# Altium project Motor_Driver_3_Phase.PrjPcb
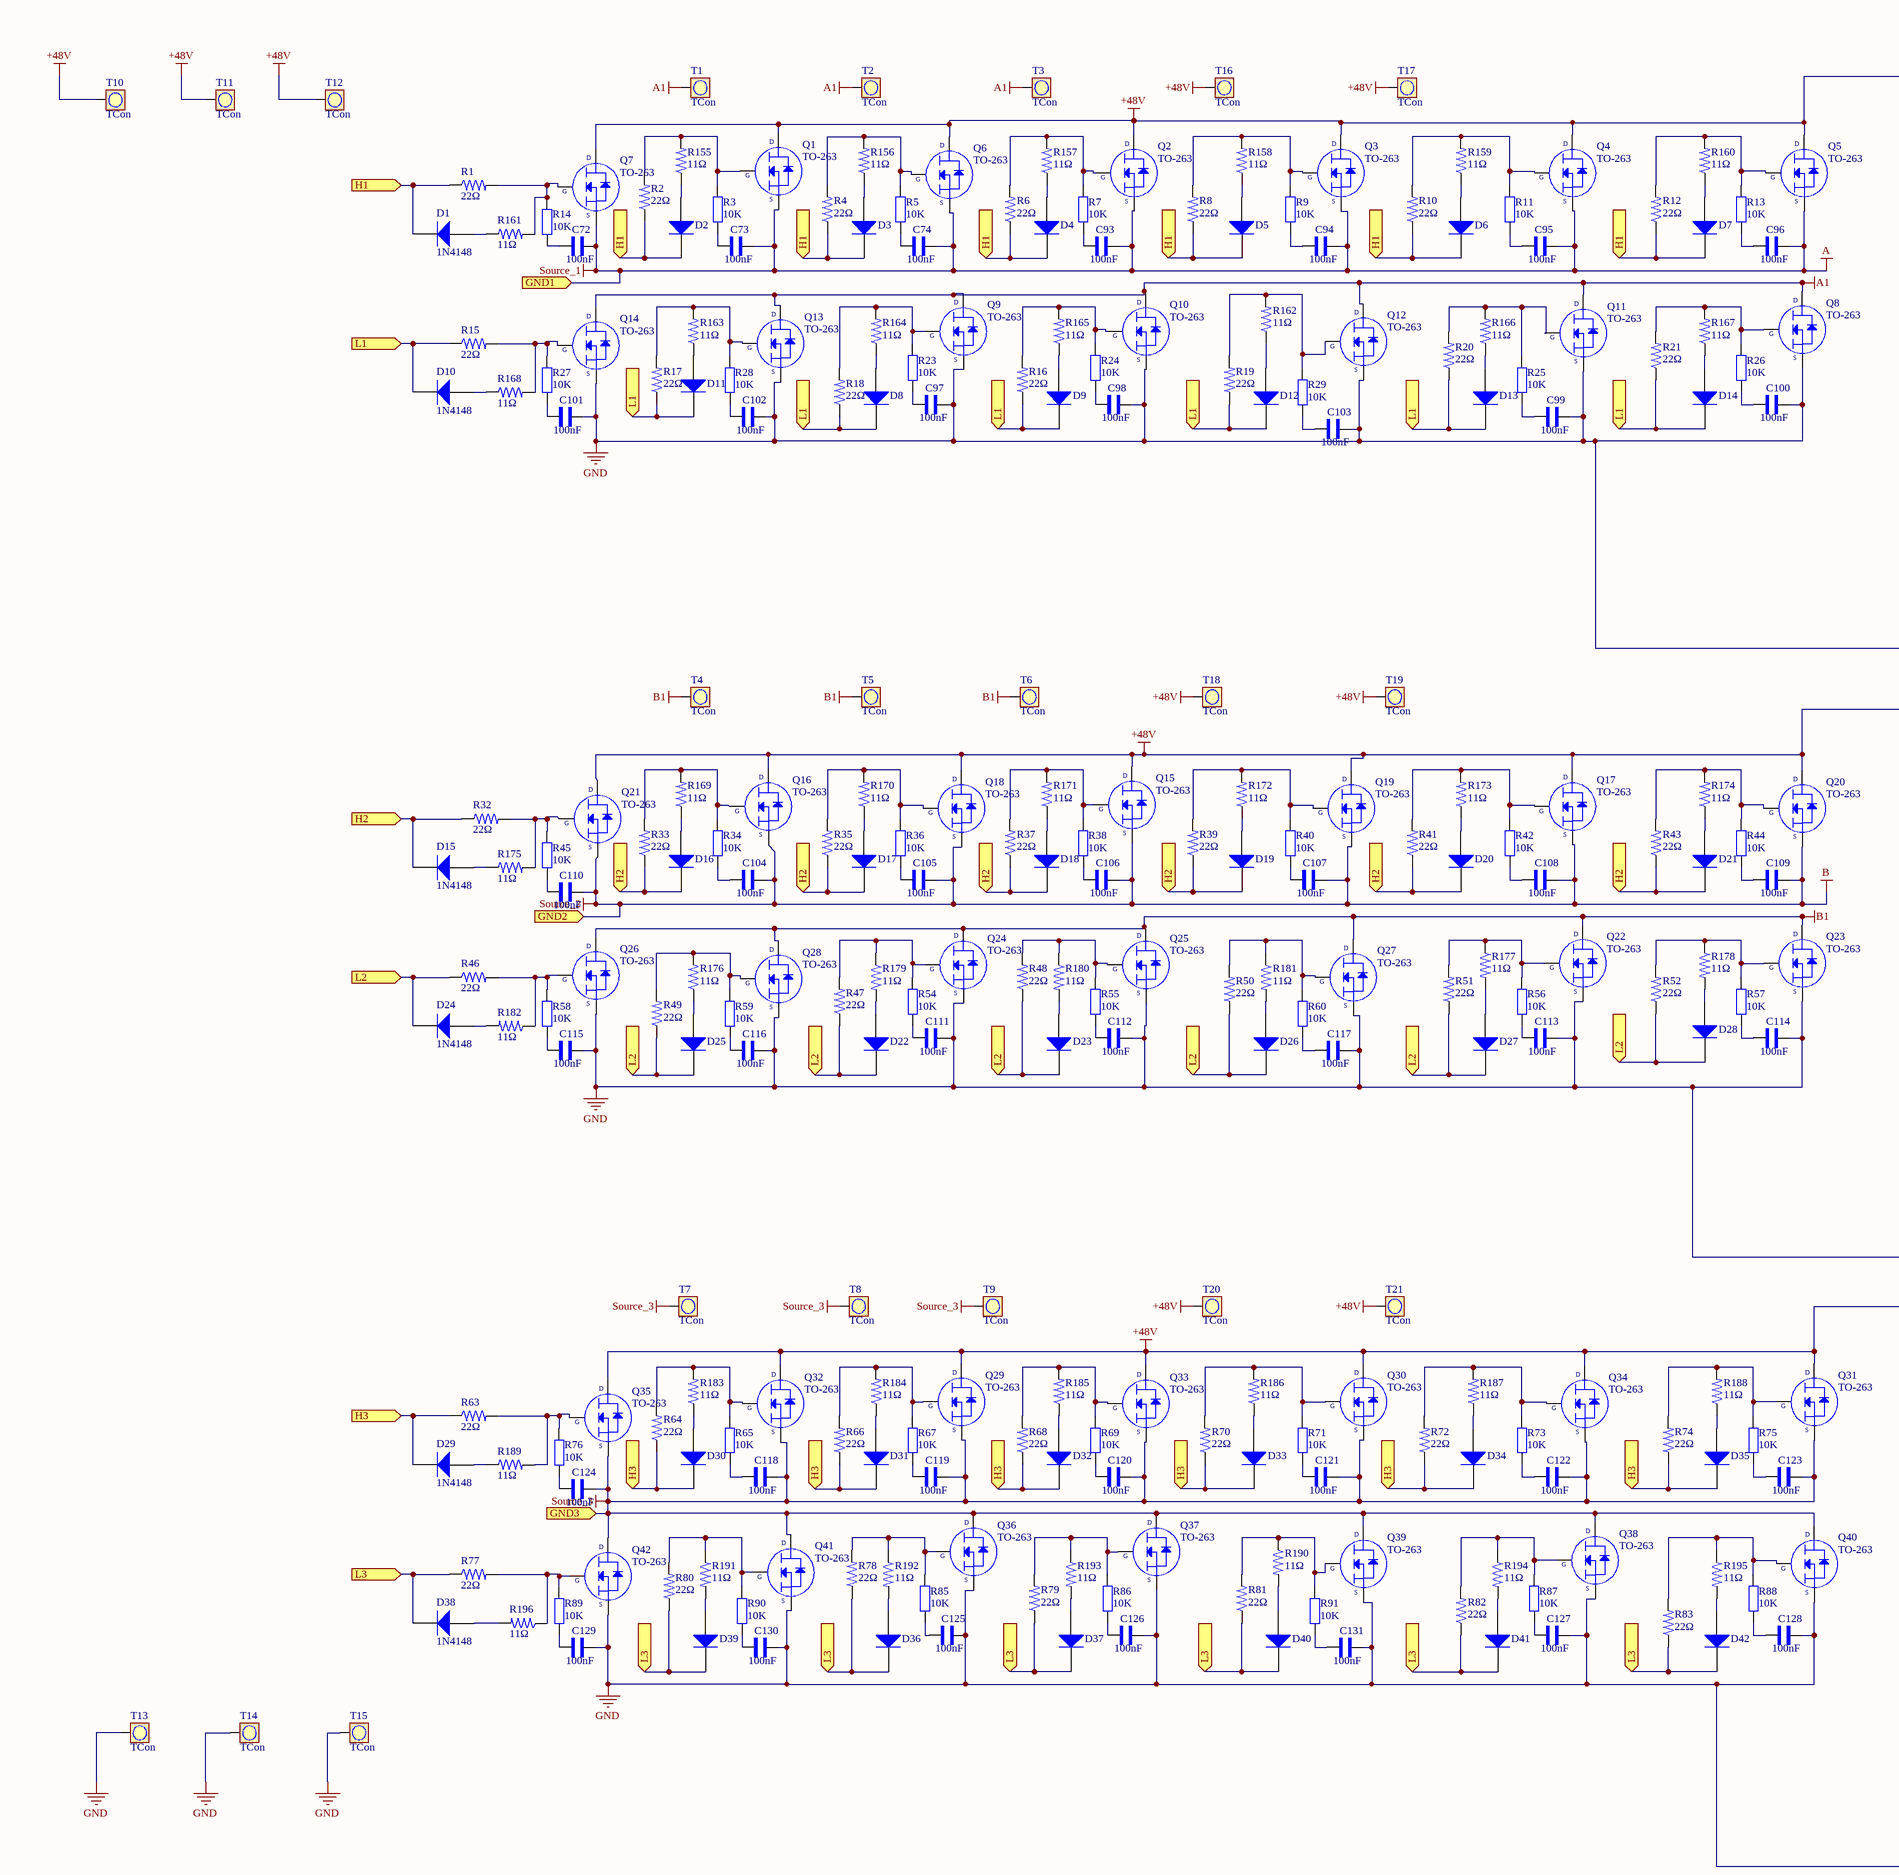
[diagram p0: Mosfet.SchDoc, left]
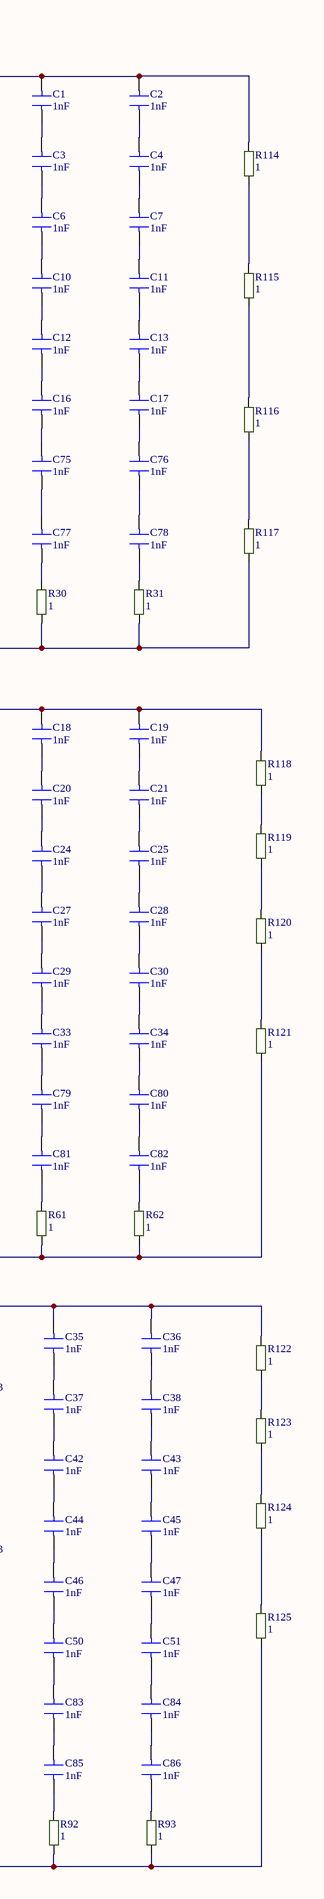
[diagram p1: Mosfet.SchDoc, right]
4 sheets, 448 parts. Net scope: flat (ports and power ports of the same name join across sheets).
Board files: Motor_Driver_3_Phase.PcbDoc, Connector.PcbDoc
Sheets:
  Mosfet.SchDoc
  Gate_Driver.SchDoc
  Parallel_Capacitor.SchDoc
  Current_Sensor.SchDoc

## Sheet Mosfet.SchDoc
size A2; SheetNumber: 1; SheetTotal: 5

### Parts
C1  1nF  [CAP 1206_3216 - 1.8MM]
C2  1nF  [CAP 1206_3216 - 1.8MM]
C3  1nF  [CAP 1206_3216 - 1.8MM]
C4  1nF  [CAP 1206_3216 - 1.8MM]
C6  1nF  [CAP 1206_3216 - 1.8MM]
C7  1nF  [CAP 1206_3216 - 1.8MM]
C10  1nF  [CAP 1206_3216 - 1.8MM]
C11  1nF  [CAP 1206_3216 - 1.8MM]
C12  1nF  [CAP 1206_3216 - 1.8MM]
C13  1nF  [CAP 1206_3216 - 1.8MM]
C16  1nF  [CAP 1206_3216 - 1.8MM]
C17  1nF  [CAP 1206_3216 - 1.8MM]
C18  1nF  [CAP 1206_3216 - 1.8MM]
C19  1nF  [CAP 1206_3216 - 1.8MM]
C20  1nF  [CAP 1206_3216 - 1.8MM]
C21  1nF  [CAP 1206_3216 - 1.8MM]
C24  1nF  [CAP 1206_3216 - 1.8MM]
C25  1nF  [CAP 1206_3216 - 1.8MM]
C27  1nF  [CAP 1206_3216 - 1.8MM]
C28  1nF  [CAP 1206_3216 - 1.8MM]
C29  1nF  [CAP 1206_3216 - 1.8MM]
C30  1nF  [CAP 1206_3216 - 1.8MM]
C33  1nF  [CAP 1206_3216 - 1.8MM]
C34  1nF  [CAP 1206_3216 - 1.8MM]
C35  1nF  [CAP 1206_3216 - 1.8MM]
C36  1nF  [CAP 1206_3216 - 1.8MM]
C37  1nF  [CAP 1206_3216 - 1.8MM]
C38  1nF  [CAP 1206_3216 - 1.8MM]
C42  1nF  [CAP 1206_3216 - 1.8MM]
C43  1nF  [CAP 1206_3216 - 1.8MM]
C44  1nF  [CAP 1206_3216 - 1.8MM]
C45  1nF  [CAP 1206_3216 - 1.8MM]
C46  1nF  [CAP 1206_3216 - 1.8MM]
C47  1nF  [CAP 1206_3216 - 1.8MM]
C50  1nF  [CAP 1206_3216 - 1.8MM]
C51  1nF  [CAP 1206_3216 - 1.8MM]
C72  100nF  [C-0805W]
C73  100nF  [C-0805W]
C74  100nF  [C-0805W]
C75  1nF  [CAP 1206_3216 - 1.8MM]
C76  1nF  [CAP 1206_3216 - 1.8MM]
C77  1nF  [CAP 1206_3216 - 1.8MM]
C78  1nF  [CAP 1206_3216 - 1.8MM]
C79  1nF  [CAP 1206_3216 - 1.8MM]
C80  1nF  [CAP 1206_3216 - 1.8MM]
C81  1nF  [CAP 1206_3216 - 1.8MM]
C82  1nF  [CAP 1206_3216 - 1.8MM]
C83  1nF  [CAP 1206_3216 - 1.8MM]
C84  1nF  [CAP 1206_3216 - 1.8MM]
C85  1nF  [CAP 1206_3216 - 1.8MM]
C86  1nF  [CAP 1206_3216 - 1.8MM]
C93  100nF  [C-0805W]
C94  100nF  [C-0805W]
C95  100nF  [C-0805W]
C96  100nF  [C-0805W]
C97  100nF  [C-0805W]
C98  100nF  [C-0805W]
C99  100nF  [C-0805W]
C100  100nF  [C-0805W]
C101  100nF  [C-0805W]
C102  100nF  [C-0805W]
C103  100nF  [C-0805W]
C104  100nF  [C-0805W]
C105  100nF  [C-0805W]
C106  100nF  [C-0805W]
C107  100nF  [C-0805W]
C108  100nF  [C-0805W]
C109  100nF  [C-0805W]
C110  100nF  [C-0805W]
C111  100nF  [C-0805W]
C112  100nF  [C-0805W]
C113  100nF  [C-0805W]
C114  100nF  [C-0805W]
C115  100nF  [C-0805W]
C116  100nF  [C-0805W]
C117  100nF  [C-0805W]
C118  100nF  [C-0805W]
C119  100nF  [C-0805W]
C120  100nF  [C-0805W]
C121  100nF  [C-0805W]
C122  100nF  [C-0805W]
C123  100nF  [C-0805W]
C124  100nF  [C-0805W]
C125  100nF  [C-0805W]
C126  100nF  [C-0805W]
C127  100nF  [C-0805W]
C128  100nF  [C-0805W]
C129  100nF  [C-0805W]
C130  100nF  [C-0805W]
C131  100nF  [C-0805W]
D1  1N4148 Diyot  [SOD-123]  (value not drawn)
D2  1N4148 Diyot  [SOD-123]  (value not drawn)
D3  1N4148 Diyot  [SOD-123]  (value not drawn)
D4  1N4148 Diyot  [SOD-123]  (value not drawn)
D5  1N4148 Diyot  [SOD-123]  (value not drawn)
D6  1N4148 Diyot  [SOD-123]  (value not drawn)
D7  1N4148 Diyot  [SOD-123]  (value not drawn)
D8  1N4148 Diyot  [SOD-123]  (value not drawn)
D9  1N4148 Diyot  [SOD-123]  (value not drawn)
D10  1N4148 Diyot  [SOD-123]  (value not drawn)
D11  1N4148 Diyot  [SOD-123]  (value not drawn)
D12  1N4148 Diyot  [SOD-123]  (value not drawn)
D13  1N4148 Diyot  [SOD-123]  (value not drawn)
D14  1N4148 Diyot  [SOD-123]  (value not drawn)
D15  1N4148 Diyot  [SOD-123]  (value not drawn)
D16  1N4148 Diyot  [SOD-123]  (value not drawn)
D17  1N4148 Diyot  [SOD-123]  (value not drawn)
D18  1N4148 Diyot  [SOD-123]  (value not drawn)
D19  1N4148 Diyot  [SOD-123]  (value not drawn)
D20  1N4148 Diyot  [SOD-123]  (value not drawn)
D21  1N4148 Diyot  [SOD-123]  (value not drawn)
D22  1N4148 Diyot  [SOD-123]  (value not drawn)
D23  1N4148 Diyot  [SOD-123]  (value not drawn)
D24  1N4148 Diyot  [SOD-123]  (value not drawn)
D25  1N4148 Diyot  [SOD-123]  (value not drawn)
D26  1N4148 Diyot  [SOD-123]  (value not drawn)
D27  1N4148 Diyot  [SOD-123]  (value not drawn)
D28  1N4148 Diyot  [SOD-123]  (value not drawn)
D29  1N4148 Diyot  [SOD-123]  (value not drawn)
D30  1N4148 Diyot  [SOD-123]  (value not drawn)
D31  1N4148 Diyot  [SOD-123]  (value not drawn)
D32  1N4148 Diyot  [SOD-123]  (value not drawn)
D33  1N4148 Diyot  [SOD-123]  (value not drawn)
D34  1N4148 Diyot  [SOD-123]  (value not drawn)
D35  1N4148 Diyot  [SOD-123]  (value not drawn)
D36  1N4148 Diyot  [SOD-123]  (value not drawn)
D37  1N4148 Diyot  [SOD-123]  (value not drawn)
D38  1N4148 Diyot  [SOD-123]  (value not drawn)
D39  1N4148 Diyot  [SOD-123]  (value not drawn)
D40  1N4148 Diyot  [SOD-123]  (value not drawn)
D41  1N4148 Diyot  [SOD-123]  (value not drawn)
D42  1N4148 Diyot  [SOD-123]  (value not drawn)
Q1  TO-263  [DPAK_TO263]
Q2  TO-263  [DPAK_TO263]
Q3  TO-263  [DPAK_TO263]
Q4  TO-263  [DPAK_TO263]
Q5  TO-263  [DPAK_TO263]
Q6  TO-263  [DPAK_TO263]
Q7  TO-263  [DPAK_TO263]
Q8  TO-263  [DPAK_TO263]
Q9  TO-263  [DPAK_TO263]
Q10  TO-263  [DPAK_TO263]
Q11  TO-263  [DPAK_TO263]
Q12  TO-263  [DPAK_TO263]
Q13  TO-263  [DPAK_TO263]
Q14  TO-263  [DPAK_TO263]
Q15  TO-263  [DPAK_TO263]
Q16  TO-263  [DPAK_TO263]
Q17  TO-263  [DPAK_TO263]
Q18  TO-263  [DPAK_TO263]
Q19  TO-263  [DPAK_TO263]
Q20  TO-263  [DPAK_TO263]
Q21  TO-263  [DPAK_TO263]
Q22  TO-263  [DPAK_TO263]
Q23  TO-263  [DPAK_TO263]
Q24  TO-263  [DPAK_TO263]
Q25  TO-263  [DPAK_TO263]
Q26  TO-263  [DPAK_TO263]
Q27  TO-263  [DPAK_TO263]
Q28  TO-263  [DPAK_TO263]
Q29  TO-263  [DPAK_TO263]
Q30  TO-263  [DPAK_TO263]
Q31  TO-263  [DPAK_TO263]
Q32  TO-263  [DPAK_TO263]
Q33  TO-263  [DPAK_TO263]
Q34  TO-263  [DPAK_TO263]
Q35  TO-263  [DPAK_TO263]
Q36  TO-263  [DPAK_TO263]
Q37  TO-263  [DPAK_TO263]
Q38  TO-263  [DPAK_TO263]
Q39  TO-263  [DPAK_TO263]
Q40  TO-263  [DPAK_TO263]
Q41  TO-263  [DPAK_TO263]
Q42  TO-263  [DPAK_TO263]
R1  22Ω  [R-1206W]
R2  22Ω  [R-1206W]
R3  Deger: 10K  [R-0805W]  (hidden comment: RES SMD 10K OHM 1% 1/8W 0805)
R4  22Ω  [R-1206W]
R5  Deger: 10K  [R-0805W]  (hidden comment: RES SMD 10K OHM 1% 1/8W 0805)
R6  22Ω  [R-1206W]
R7  Deger: 10K  [R-0805W]  (hidden comment: RES SMD 10K OHM 1% 1/8W 0805)
R8  22Ω  [R-1206W]
R9  Deger: 10K  [R-0805W]  (hidden comment: RES SMD 10K OHM 1% 1/8W 0805)
R10  22Ω  [R-1206W]
R11  Deger: 10K  [R-0805W]  (hidden comment: RES SMD 10K OHM 1% 1/8W 0805)
R12  22Ω  [R-1206W]
R13  Deger: 10K  [R-0805W]  (hidden comment: RES SMD 10K OHM 1% 1/8W 0805)
R14  Deger: 10K  [R-0805W]  (hidden comment: RES SMD 10K OHM 1% 1/8W 0805)
R15  22Ω  [R-1206W]
R16  22Ω  [R-1206W]
R17  22Ω  [R-1206W]
R18  22Ω  [R-1206W]
R19  22Ω  [R-1206W]
R20  22Ω  [R-1206W]
R21  22Ω  [R-1206W]
R23  Deger: 10K  [R-0805W]  (hidden comment: RES SMD 10K OHM 1% 1/8W 0805)
R24  Deger: 10K  [R-0805W]  (hidden comment: RES SMD 10K OHM 1% 1/8W 0805)
R25  Deger: 10K  [R-0805W]  (hidden comment: RES SMD 10K OHM 1% 1/8W 0805)
R26  Deger: 10K  [R-0805W]  (hidden comment: RES SMD 10K OHM 1% 1/8W 0805)
R27  Deger: 10K  [R-0805W]  (hidden comment: RES SMD 10K OHM 1% 1/8W 0805)
R28  Deger: 10K  [R-0805W]  (hidden comment: RES SMD 10K OHM 1% 1/8W 0805)
R29  Deger: 10K  [R-0805W]  (hidden comment: RES SMD 10K OHM 1% 1/8W 0805)
R30  1  [R-2512W]
R31  1  [R-2512W]
R32  22Ω  [R-1206W]
R33  22Ω  [R-1206W]
R34  Deger: 10K  [R-0805W]  (hidden comment: RES SMD 10K OHM 1% 1/8W 0805)
R35  22Ω  [R-1206W]
R36  Deger: 10K  [R-0805W]  (hidden comment: RES SMD 10K OHM 1% 1/8W 0805)
R37  22Ω  [R-1206W]
R38  Deger: 10K  [R-0805W]  (hidden comment: RES SMD 10K OHM 1% 1/8W 0805)
R39  22Ω  [R-1206W]
R40  Deger: 10K  [R-0805W]  (hidden comment: RES SMD 10K OHM 1% 1/8W 0805)
R41  22Ω  [R-1206W]
R42  Deger: 10K  [R-0805W]  (hidden comment: RES SMD 10K OHM 1% 1/8W 0805)
R43  22Ω  [R-1206W]
R44  Deger: 10K  [R-0805W]  (hidden comment: RES SMD 10K OHM 1% 1/8W 0805)
R45  Deger: 10K  [R-0805W]  (hidden comment: RES SMD 10K OHM 1% 1/8W 0805)
R46  22Ω  [R-1206W]
R47  22Ω  [R-1206W]
R48  22Ω  [R-1206W]
R49  22Ω  [R-1206W]
R50  22Ω  [R-1206W]
R51  22Ω  [R-1206W]
R52  22Ω  [R-1206W]
R54  Deger: 10K  [R-0805W]  (hidden comment: RES SMD 10K OHM 1% 1/8W 0805)
R55  Deger: 10K  [R-0805W]  (hidden comment: RES SMD 10K OHM 1% 1/8W 0805)
R56  Deger: 10K  [R-0805W]  (hidden comment: RES SMD 10K OHM 1% 1/8W 0805)
R57  Deger: 10K  [R-0805W]  (hidden comment: RES SMD 10K OHM 1% 1/8W 0805)
R58  Deger: 10K  [R-0805W]  (hidden comment: RES SMD 10K OHM 1% 1/8W 0805)
R59  Deger: 10K  [R-0805W]  (hidden comment: RES SMD 10K OHM 1% 1/8W 0805)
R60  Deger: 10K  [R-0805W]  (hidden comment: RES SMD 10K OHM 1% 1/8W 0805)
R61  1  [R-2512W]
R62  1  [R-2512W]
R63  22Ω  [R-1206W]
R64  22Ω  [R-1206W]
R65  Deger: 10K  [R-0805W]  (hidden comment: RES SMD 10K OHM 1% 1/8W 0805)
R66  22Ω  [R-1206W]
R67  Deger: 10K  [R-0805W]  (hidden comment: RES SMD 10K OHM 1% 1/8W 0805)
R68  22Ω  [R-1206W]
R69  Deger: 10K  [R-0805W]  (hidden comment: RES SMD 10K OHM 1% 1/8W 0805)
R70  22Ω  [R-1206W]
R71  Deger: 10K  [R-0805W]  (hidden comment: RES SMD 10K OHM 1% 1/8W 0805)
R72  22Ω  [R-1206W]
R73  Deger: 10K  [R-0805W]  (hidden comment: RES SMD 10K OHM 1% 1/8W 0805)
R74  22Ω  [R-1206W]
R75  Deger: 10K  [R-0805W]  (hidden comment: RES SMD 10K OHM 1% 1/8W 0805)
R76  Deger: 10K  [R-0805W]  (hidden comment: RES SMD 10K OHM 1% 1/8W 0805)
R77  22Ω  [R-1206W]
R78  22Ω  [R-1206W]
R79  22Ω  [R-1206W]
R80  22Ω  [R-1206W]
R81  22Ω  [R-1206W]
R82  22Ω  [R-1206W]
R83  22Ω  [R-1206W]
R85  Deger: 10K  [R-0805W]  (hidden comment: RES SMD 10K OHM 1% 1/8W 0805)
R86  Deger: 10K  [R-0805W]  (hidden comment: RES SMD 10K OHM 1% 1/8W 0805)
R87  Deger: 10K  [R-0805W]  (hidden comment: RES SMD 10K OHM 1% 1/8W 0805)
R88  Deger: 10K  [R-0805W]  (hidden comment: RES SMD 10K OHM 1% 1/8W 0805)
R89  Deger: 10K  [R-0805W]  (hidden comment: RES SMD 10K OHM 1% 1/8W 0805)
R90  Deger: 10K  [R-0805W]  (hidden comment: RES SMD 10K OHM 1% 1/8W 0805)
R91  Deger: 10K  [R-0805W]  (hidden comment: RES SMD 10K OHM 1% 1/8W 0805)
R92  1  [R-2512W]
R93  1  [R-2512W]
R114  1  [R-2512W]
R115  1  [R-2512W]
R116  1  [R-2512W]
R117  1  [R-2512W]
R118  1  [R-2512W]
R119  1  [R-2512W]
R120  1  [R-2512W]
R121  1  [R-2512W]
R122  1  [R-2512W]
R123  1  [R-2512W]
R124  1  [R-2512W]
R125  1  [R-2512W]
R155  11Ω  [R-1206W]
R156  11Ω  [R-1206W]
R157  11Ω  [R-1206W]
R158  11Ω  [R-1206W]
R159  11Ω  [R-1206W]
R160  11Ω  [R-1206W]
R161  11Ω  [R-1206W]
R162  11Ω  [R-1206W]
R163  11Ω  [R-1206W]
R164  11Ω  [R-1206W]
R165  11Ω  [R-1206W]
R166  11Ω  [R-1206W]
R167  11Ω  [R-1206W]
R168  11Ω  [R-1206W]
R169  11Ω  [R-1206W]
R170  11Ω  [R-1206W]
R171  11Ω  [R-1206W]
R172  11Ω  [R-1206W]
R173  11Ω  [R-1206W]
R174  11Ω  [R-1206W]
R175  11Ω  [R-1206W]
R176  11Ω  [R-1206W]
R177  11Ω  [R-1206W]
R178  11Ω  [R-1206W]
R179  11Ω  [R-1206W]
R180  11Ω  [R-1206W]
R181  11Ω  [R-1206W]
R182  11Ω  [R-1206W]
R183  11Ω  [R-1206W]
R184  11Ω  [R-1206W]
R185  11Ω  [R-1206W]
R186  11Ω  [R-1206W]
R187  11Ω  [R-1206W]
R188  11Ω  [R-1206W]
R189  11Ω  [R-1206W]
R190  11Ω  [R-1206W]
R191  11Ω  [R-1206W]
R192  11Ω  [R-1206W]
R193  11Ω  [R-1206W]
R194  11Ω  [R-1206W]
R195  11Ω  [R-1206W]
R196  11Ω  [R-1206W]
T1  TCon  [connectorout]
T2  TCon  [connectorout]
T3  TCon  [connectorout]
T4  TCon  [connectorout]
T5  TCon  [connectorout]
T6  TCon  [connectorout]
T7  TCon  [connectorout]
T8  TCon  [connectorout]
T9  TCon  [connectorout]
T10  TCon  [connectorout]
T11  TCon  [connectorout]
T12  TCon  [connectorout]
T13  TCon  [connectorout]
T14  TCon  [connectorout]
T15  TCon  [connectorout]
T16  TCon  [connectorout]
T17  TCon  [connectorout]
T18  TCon  [connectorout]
T19  TCon  [connectorout]
T20  TCon  [connectorout]
T21  TCon  [connectorout]

### Ports
GND1 (in), GND2 (in), GND3 (in), H1 (in), H2 (in), H3 (in), L1 (in), L2 (in), L3 (in)

### Nets
+48V: C1.2 C2.2 C18.2 C19.2 C35.2 C36.2 Q1.3 Q2.3 Q3.3 Q4.3 Q5.3 Q6.3 Q7.3 Q15.3 Q16.3 Q17.3 Q18.3 Q19.3 Q20.3 Q21.3 Q29.3 Q30.3 Q31.3 Q32.3 Q33.3 Q34.3 Q35.3 R114.2 R118.2 R122.2 T10.1 T11.1 T12.1 T16.1 T17.1 T18.1 T19.1 T20.1 T21.1
A: C72.1 C73.1 C74.1 C93.1 C94.1 C95.1 C96.1 Q1.2 Q2.2 Q3.2 Q4.2 Q5.2 Q6.2 Q7.2 ; port GND1  [also labelled Source_1]
A1: Q8.3 Q9.3 Q10.3 Q11.3 Q12.3 Q13.3 Q14.3 T1.1 T2.1 T3.1
B: C104.1 C105.1 C106.1 C107.1 C108.1 C109.1 C110.1 Q15.2 Q16.2 Q17.2 Q18.2 Q19.2 Q20.2 Q21.2 ; port GND2  [also labelled Source_2]
B1: Q22.3 Q23.3 Q24.3 Q25.3 Q26.3 Q27.3 Q28.3 T4.1 T5.1 T6.1
GND: C97.1 C98.1 C99.1 C100.1 C101.1 C102.1 C103.1 C111.1 C112.1 C113.1 C114.1 C115.1 C116.1 C117.1 C125.1 C126.1 C127.1 C128.1 C129.1 C130.1 C131.1 Q8.2 Q9.2 Q10.2 Q11.2 Q12.2 Q13.2 Q14.2 Q22.2 Q23.2 Q24.2 Q25.2 Q26.2 Q27.2 Q28.2 Q36.2 Q37.2 Q38.2 Q39.2 Q40.2 Q41.2 Q42.2 R30.1 R31.1 R61.1 R62.1 R92.1 R93.1 R117.1 R121.1 R125.1 T13.1 T14.1 T15.1
Source_3: C118.1 C119.1 C120.1 C121.1 C122.1 C123.1 C124.1 Q29.2 Q30.2 Q31.2 Q32.2 Q33.2 Q34.2 Q35.2 Q36.3 Q37.3 Q38.3 Q39.3 Q40.3 Q41.3 Q42.3 T7.1 T8.1 T9.1 ; port GND3
NetC1_1: C1.1 C3.2
NetC2_1: C2.1 C4.2
NetC3_1: C3.1 C6.2
NetC4_1: C4.1 C7.2
NetC6_1: C6.1 C10.2
NetC7_1: C7.1 C11.2
NetC10_1: C10.1 C12.2
NetC11_1: C11.1 C13.2
NetC12_1: C12.1 C16.2
NetC13_1: C13.1 C17.2
NetC16_1: C16.1 C75.2
NetC17_1: C17.1 C76.2
NetC18_1: C18.1 C20.2
NetC19_1: C19.1 C21.2
NetC20_1: C20.1 C24.2
NetC21_1: C21.1 C25.2
NetC24_1: C24.1 C27.2
NetC25_1: C25.1 C28.2
NetC27_1: C27.1 C29.2
NetC28_1: C28.1 C30.2
NetC29_1: C29.1 C33.2
NetC30_1: C30.1 C34.2
NetC33_1: C33.1 C79.2
NetC34_1: C34.1 C80.2
NetC35_1: C35.1 C37.2
NetC36_1: C36.1 C38.2
NetC37_1: C37.1 C42.2
NetC38_1: C38.1 C43.2
NetC42_1: C42.1 C44.2
NetC43_1: C43.1 C45.2
NetC44_1: C44.1 C46.2
NetC45_1: C45.1 C47.2
NetC46_1: C46.1 C50.2
NetC47_1: C47.1 C51.2
NetC50_1: C50.1 C83.2
NetC51_1: C51.1 C84.2
NetC72_2: C72.2 R14.1
NetC73_2: C73.2 R3.1
NetC74_2: C74.2 R5.1
NetC75_1: C75.1 C77.2
NetC76_1: C76.1 C78.2
NetC77_1: C77.1 R30.2
NetC78_1: C78.1 R31.2
NetC79_1: C79.1 C81.2
NetC80_1: C80.1 C82.2
NetC81_1: C81.1 R61.2
NetC82_1: C82.1 R62.2
NetC83_1: C83.1 C85.2
NetC84_1: C84.1 C86.2
NetC85_1: C85.1 R92.2
NetC86_1: C86.1 R93.2
NetC93_2: C93.2 R7.1
NetC94_2: C94.2 R9.1
NetC95_2: C95.2 R11.1
NetC96_2: C96.2 R13.1
NetC97_2: C97.2 R23.1
NetC98_2: C98.2 R24.1
NetC99_2: C99.2 R25.1
NetC100_2: C100.2 R26.1
NetC101_2: C101.2 R27.1
NetC102_2: C102.2 R28.1
NetC103_2: C103.2 R29.1
NetC104_2: C104.2 R34.1
NetC105_2: C105.2 R36.1
NetC106_2: C106.2 R38.1
NetC107_2: C107.2 R40.1
NetC108_2: C108.2 R42.1
NetC109_2: C109.2 R44.1
NetC110_2: C110.2 R45.1
NetC111_2: C111.2 R54.1
NetC112_2: C112.2 R55.1
NetC113_2: C113.2 R56.1
NetC114_2: C114.2 R57.1
NetC115_2: C115.2 R58.1
NetC116_2: C116.2 R59.1
NetC117_2: C117.2 R60.1
NetC118_2: C118.2 R65.1
NetC119_2: C119.2 R67.1
NetC120_2: C120.2 R69.1
NetC121_2: C121.2 R71.1
NetC122_2: C122.2 R73.1
NetC123_2: C123.2 R75.1
NetC124_2: C124.2 R76.1
NetC125_2: C125.2 R85.1
NetC126_2: C126.2 R86.1
NetC127_2: C127.2 R87.1
NetC128_2: C128.2 R88.1
NetC129_2: C129.2 R89.1
NetC130_2: C130.2 R90.1
NetC131_2: C131.2 R91.1
NetD1_1: D1.1(A) R161.1
NetD1_2: D1.2(K) D2.2(K) D3.2(K) D4.2(K) D5.2(K) D6.2(K) D7.2(K) R1.1 R2.1 R4.1 R6.1 R8.1 R10.1 R12.1 ; port H1
NetD2_1: D2.1(A) R155.1
NetD3_1: D3.1(A) R156.1
NetD4_1: D4.1(A) R157.1
NetD5_1: D5.1(A) R158.1
NetD6_1: D6.1(A) R159.1
NetD7_1: D7.1(A) R160.1
NetD8_1: D8.1(A) R164.1
NetD8_2: D8.2(K) D9.2(K) D10.2(K) D11.2(K) D12.2(K) D13.2(K) D14.2(K) R15.1 R16.1 R17.1 R18.1 R19.1 R20.1 R21.1 ; port L1
NetD9_1: D9.1(A) R165.1
NetD10_1: D10.1(A) R168.1
NetD11_1: D11.1(A) R163.1
NetD12_1: D12.1(A) R162.1
NetD13_1: D13.1(A) R166.1
NetD14_1: D14.1(A) R167.1
NetD15_1: D15.1(A) R175.1
NetD15_2: D15.2(K) D16.2(K) D17.2(K) D18.2(K) D19.2(K) D20.2(K) D21.2(K) R32.1 R33.1 R35.1 R37.1 R39.1 R41.1 R43.1 ; port H2
NetD16_1: D16.1(A) R169.1
NetD17_1: D17.1(A) R170.1
NetD18_1: D18.1(A) R171.1
NetD19_1: D19.1(A) R172.1
NetD20_1: D20.1(A) R173.1
NetD21_1: D21.1(A) R174.1
NetD22_1: D22.1(A) R179.2
NetD22_2: D22.2(K) D23.2(K) D24.2(K) D25.2(K) D26.2(K) D27.2(K) D28.2(K) R46.1 R47.1 R48.1 R49.1 R50.1 R51.1 R52.1 ; port L2
NetD23_1: D23.1(A) R180.2
NetD24_1: D24.1(A) R182.2
NetD25_1: D25.1(A) R176.1
NetD26_1: D26.1(A) R181.2
NetD27_1: D27.1(A) R177.2
NetD28_1: D28.1(A) R178.2
NetD29_1: D29.1(A) R189.1
NetD29_2: D29.2(K) D30.2(K) D31.2(K) D32.2(K) D33.2(K) D34.2(K) D35.2(K) R63.1 R64.1 R66.1 R68.1 R70.1 R72.1 R74.1 ; port H3
NetD30_1: D30.1(A) R183.1
NetD31_1: D31.1(A) R184.1
NetD32_1: D32.1(A) R185.1
NetD33_1: D33.1(A) R186.1
NetD34_1: D34.1(A) R187.1
NetD35_1: D35.1(A) R188.1
NetD36_1: D36.1(A) R192.2
NetD36_2: D36.2(K) D37.2(K) D38.2(K) D39.2(K) D40.2(K) D41.2(K) D42.2(K) R77.1 R78.1 R79.1 R80.1 R81.1 R82.1 R83.1 ; port L3
NetD37_1: D37.1(A) R193.2
NetD38_1: D38.1(A) R196.2
NetD39_1: D39.1(A) R191.2
NetD40_1: D40.1(A) R190.2
NetD41_1: D41.1(A) R194.2
NetD42_1: D42.1(A) R195.2
NetQ1_1: Q1.1 R2.2 R3.2 R155.2
NetQ2_1: Q2.1 R6.2 R7.2 R157.2
NetQ3_1: Q3.1 R8.2 R9.2 R158.2
NetQ4_1: Q4.1 R10.2 R11.2 R159.2
NetQ5_1: Q5.1 R12.2 R13.2 R160.2
NetQ6_1: Q6.1 R4.2 R5.2 R156.2
NetQ7_1: Q7.1 R1.2 R14.2 R161.2
NetQ8_1: Q8.1 R21.2 R26.2 R167.2
NetQ9_1: Q9.1 R18.2 R23.2 R164.2
NetQ10_1: Q10.1 R16.2 R24.2 R165.2
NetQ11_1: Q11.1 R20.2 R25.2 R166.2
NetQ12_1: Q12.1 R19.2 R29.2 R162.2
NetQ13_1: Q13.1 R17.2 R28.2 R163.2
NetQ14_1: Q14.1 R15.2 R27.2 R168.2
NetQ15_1: Q15.1 R37.2 R38.2 R171.2
NetQ16_1: Q16.1 R33.2 R34.2 R169.2
NetQ17_1: Q17.1 R41.2 R42.2 R173.2
NetQ18_1: Q18.1 R35.2 R36.2 R170.2
NetQ19_1: Q19.1 R39.2 R40.2 R172.2
NetQ20_1: Q20.1 R43.2 R44.2 R174.2
NetQ21_1: Q21.1 R32.2 R45.2 R175.2
NetQ22_1: Q22.1 R51.2 R56.2 R177.1
NetQ23_1: Q23.1 R52.2 R57.2 R178.1
NetQ24_1: Q24.1 R47.2 R54.2 R179.1
NetQ25_1: Q25.1 R48.2 R55.2 R180.1
NetQ26_1: Q26.1 R46.2 R58.2 R182.1
NetQ27_1: Q27.1 R50.2 R60.2 R181.1
NetQ28_1: Q28.1 R49.2 R59.2 R176.2
NetQ29_1: Q29.1 R66.2 R67.2 R184.2
NetQ30_1: Q30.1 R70.2 R71.2 R186.2
NetQ31_1: Q31.1 R74.2 R75.2 R188.2
NetQ32_1: Q32.1 R64.2 R65.2 R183.2
NetQ33_1: Q33.1 R68.2 R69.2 R185.2
NetQ34_1: Q34.1 R72.2 R73.2 R187.2
NetQ35_1: Q35.1 R63.2 R76.2 R189.2
NetQ36_1: Q36.1 R78.2 R85.2 R192.1
NetQ37_1: Q37.1 R79.2 R86.2 R193.1
NetQ38_1: Q38.1 R82.2 R87.2 R194.1
NetQ39_1: Q39.1 R81.2 R91.2 R190.1
NetQ40_1: Q40.1 R83.2 R88.2 R195.1
NetQ41_1: Q41.1 R80.2 R90.2 R191.1
NetQ42_1: Q42.1 R77.2 R89.2 R196.1
NetR114_1: R114.1 R115.2
NetR115_1: R115.1 R116.2
NetR116_1: R116.1 R117.2
NetR118_1: R118.1 R119.2
NetR119_1: R119.1 R120.2
NetR120_1: R120.1 R121.2
NetR122_1: R122.1 R123.2
NetR123_1: R123.1 R124.2
NetR124_1: R124.1 R125.2

### Notes on the sheet
- (in symbol TO-263) D; G; S

### Library data of the parts
C1-C4 C6 C7 C10-C13 C16-C21 C24 C25 C27-C30 C33-C38 C42-C47 C50 C51 C75-C86 = CAP 1nF 1206
C72-C74 C93-C131 = CAP 100nF 50V SMT 0805: WCAP-CSGP General Purpose MLCC; SMT 0805; X7R; 100nF 10%; 50V; -55C to +125C; Tech. PN X7R0805104K050DFCT10000; MF: Wurth Electronics Inc; MP: 885012207098; Availability: Warning; Mouser-Purchase-URL: https://snapeda.com/shop?store=Mouser&id=4217223; Price: None; DigiKey-Purchase-URL: https://snapeda.com/shop?store=DigiKey&id=4217223; Package: 0805 Wurth Electronics; Value: *; SnapEDA_Link: https://www.snapeda.com/parts/885012207098/Wurth%20Electronics%20Inc/view-part/4217223/?ref=snap; BuyPart: https://www.snapeda.com/parts/885012207098/Wurth%20Electronics%20Inc/view-part/4217223/?ref=eda
D1-D42 = 1N4148: DIODE GEN PURP 100V 150MA SOD123; Uretici Kodu: 1N4148W-TP; -Sicaklik: -65; +Sicaklik: +150; Lehim Yöntemi: SMD; Cins: Diyot; Kılıf: SOD123; MSL: 1 (Unlimited); Deger: 1N4148
R1 R2 R4 R6 R8 R10 R12 R15-R21 R32 R33 R35 R37 R39 R41 R43 R46-R52 R63 R64 R66 R68 R70 R72 R74 R77-R83 = RES 22Ω 1206: CRG1206 1% 22R; MP: 1623463-1; Package: None; Price: None; Value: *; Availability: Unavailable
R3 R5 R7 R9 R11 R13 R14 R23-R29 R34 R36 R38 R40 R42 R44 R45 R54-R60 R65 R67 R69 R71 R73 R75 R76 R85-R91 = 10K 0805: 10 kOhms ±1% 0.125W, 1/8W Chip Resistor 0805 (2012 Metric) Moisture Resistant Thick Film; Cins: Direnc; Kılıf: 0805; Uretici Kodu: RC0805FR-0710KL; -Sicaklik: -55; +Sicaklik: +155; Lehim Yöntemi: SMD; MSL: 1 (Unlimited)
R30 R31 R61 R62 R92 R93 R114-R125 = 0207 melf: ComponentLink1Description: https://www.ozdisan.com/pasif-komponentler/direncler/smt-smd-direncler/M271UFG100KT20; ComponentLink1URL: https://www.ozdisan.com/pasif-komponentler/direncler/smt-smd-direncler/M271UFG100KT20
R155-R196 = RES 11Ω 1206: CRG1206 1% 11R; MP: 1623463-1; Package: None; Price: None; Value: *; Availability: Unavailable
T1-T21 = Terminal Connector: ComponentLink1Description: https://www.ozdisan.com/konnektor-baglanti-elemanlari/terminal-konnektorler/vida-tipi-konnektorler/K36-00AH; ComponentLink1URL: https://www.ozdisan.com/konnektor-baglanti-elemanlari/terminal-konnektorler/vida-tipi-konnektorler/K36-00AH

## Sheet Gate_Driver.SchDoc
size A4
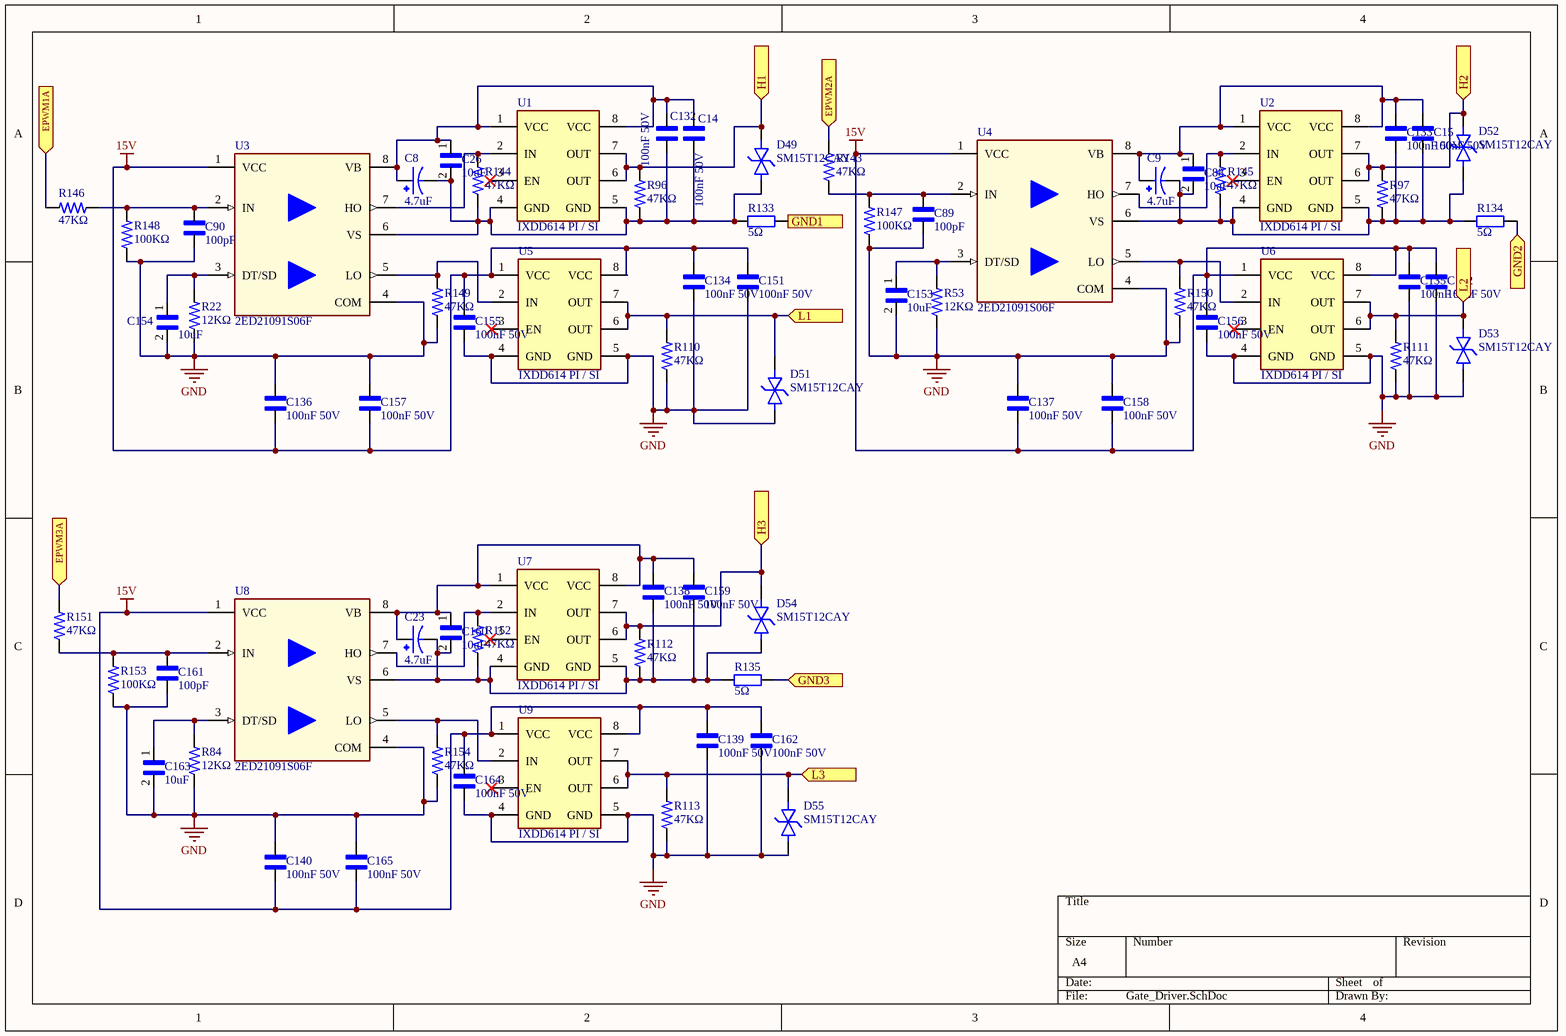
[diagram p2: Gate_Driver.SchDoc]

### Parts
C8  4.7uF  [CAP ALSMD POLY 4.3MM H5.5MM]
C9  4.7uF  [CAP ALSMD POLY 4.3MM H5.5MM]
C14  100nF 50V  [C-0805W]
C15  100nF 50V  [C-0805W]
C23  4.7uF  [CAP ALSMD POLY 4.3MM H5.5MM]
C26  10uF  [C-0805R]
C88  10uF  [C-0805R]
C89  100pF  [C-0805R]
C90  100pF  [C-0805R]
C132  100nF 50V  [C-0805W]
C133  100nF 50V  [C-0805W]
C134  100nF 50V  [C-0805W]
C135  100nF 50V  [C-0805W]
C136  100nF 50V  [C-0805W]
C137  100nF 50V  [C-0805W]
C138  100nF 50V  [C-0805W]
C139  100nF 50V  [C-0805W]
C140  100nF 50V  [C-0805W]
C151  100nF 50V  [C-0805W]
C152  100nF 50V  [C-0805W]
C153  10uF  [C-0805R]
C154  10uF  [C-0805R]
C155  100nF 50V  [C-0805W]
C156  100nF 50V  [C-0805W]
C157  100nF 50V  [C-0805W]
C158  100nF 50V  [C-0805W]
C159  100nF 50V  [C-0805W]
C160  10uF  [C-0805R]
C161  100pF  [C-0805R]
C162  100nF 50V  [C-0805W]
C163  10uF  [C-0805R]
C164  100nF 50V  [C-0805W]
C165  100nF 50V  [C-0805W]
D49  SM15T12CAY  [DIOM7959X262N]
D51  SM15T12CAY  [DIOM7959X262N]
D52  SM15T12CAY  [DIOM7959X262N]
D53  SM15T12CAY  [DIOM7959X262N]
D54  SM15T12CAY  [DIOM7959X262N]
D55  SM15T12CAY  [DIOM7959X262N]
R22  12KΩ  [R-1206W]
R53  12KΩ  [R-1206W]
R84  12KΩ  [R-1206W]
R96  47KΩ  [RESC3015X65N]
R97  47KΩ  [RESC3015X65N]
R110  47KΩ  [RESC3015X65N]
R111  47KΩ  [RESC3015X65N]
R112  47KΩ  [RESC3015X65N]
R113  47KΩ  [RESC3015X65N]
R133  5Ω  [R-1206W]
R134  5Ω  [R-1206W]
R135  5Ω  [R-1206W]
R143  47KΩ  [RESC3015X65N]
R144  47KΩ  [RESC3015X65N]
R145  47KΩ  [RESC3015X65N]
R146  47KΩ  [RESC3015X65N]
R147  100KΩ  [R-0805R]
R148  100KΩ  [R-0805R]
R149  47KΩ  [RESC3015X65N]
R150  47KΩ  [RESC3015X65N]
R151  47KΩ  [RESC3015X65N]
R152  47KΩ  [RESC3015X65N]
R153  100KΩ  [R-0805R]
R154  47KΩ  [RESC3015X65N]
U1  IXDD614 PI / SI  [SOIC8-IXD_614]
U2  IXDD614 PI / SI  [SOIC8-IXD_614]
U3  2ED21091S06F  [SOIC127P600X172-8N-1-V]
U4  2ED21091S06F  [SOIC127P600X172-8N-1-V]
U5  IXDD614 PI / SI  [SOIC8-IXD_614]
U6  IXDD614 PI / SI  [SOIC8-IXD_614]
U7  IXDD614 PI / SI  [SOIC8-IXD_614]
U8  2ED21091S06F  [SOIC127P600X172-8N-1-V]
U9  IXDD614 PI / SI  [SOIC8-IXD_614]

### Ports
EPWM1A (in), EPWM2A (in), EPWM3A (in), GND1 (in), GND2 (in), GND3 (in), H1 (in), H2 (in), H3 (in), L1 (in), L2 (in), L3 (in)

### Nets
15V: C134.2 C135.2 C136.1 C137.1 C139.2 C140.1 C151.2 C152.2 C155.2 C156.2 C157.1 C158.1 C162.2 C164.2 C165.1 U3.1(VCC) U4.1(VCC) U5.1(VCC) U5.8(VCC) U6.1(VCC) U6.8(VCC) U8.1(VCC) U9.1(VCC) U9.8(VCC)
A: R133.2 ; port GND1
B: R134.2 ; port GND2
GND: C89.1 C90.1 C134.1 C135.1 C136.2 C137.2 C139.1 C140.2 C151.1 C152.1 C153.2 C154.2 C155.1 C156.1 C157.2 C158.2 C161.1 C162.1 C163.2 C164.1 C165.2 D51.1 D53.1 D55.1 R22.1 R53.1 R84.1 R110.1 R111.1 R113.1 R147.1 R148.1 R149.1 R150.1 R153.1 R154.1 U3.4(COM) U4.4(COM) U5.4(GND) U5.5(GND) U6.4(GND) U6.5(GND) U8.4(COM) U9.4(GND) U9.5(GND)
Source_3: R135.2 ; port GND3
NetC8_1: C8.1 C14.2 C26.1 C132.2 U1.1(VCC) U1.8(VCC) U3.8(VB)
NetC8_2: C8.2 C14.1 C26.2 C132.1 D49.1 R96.1 R133.1 R144.1 U1.4(GND) U1.5(GND) U3.6(VS)
NetC9_1: C9.1 C15.2 C88.1 C133.2 U2.1(VCC) U2.8(VCC) U4.8(VB)
NetC9_2: C9.2 C15.1 C88.2 C133.1 D52.1 R97.1 R134.1 R145.1 U2.4(GND) U2.5(GND) U4.6(VS)
NetC23_1: C23.1 C138.2 C159.2 C160.1 U7.1(VCC) U7.8(VCC) U8.8(VB)
NetC23_2: C23.2 C138.1 C159.1 C160.2 D54.1 R112.1 R135.1 R152.1 U7.4(GND) U7.5(GND) U8.6(VS)
NetC89_2: C89.2 R143.1 R147.2 U4.2(IN)
NetC90_2: C90.2 R146.1 R148.2 U3.2(IN)
NetC153_1: C153.1 R53.2 U4.3(DT/SD)
NetC154_1: C154.1 R22.2 U3.3(DT/SD)
NetC161_2: C161.2 R151.1 R153.2 U8.2(IN)
NetC163_1: C163.1 R84.2 U8.3(DT/SD)
NetD1_2: D49.2 R96.2 U1.6(OUT) U1.7(OUT) ; port H1
NetD8_2: D51.2 R110.2 U5.6(OUT) U5.7(OUT) ; port L1
NetD15_2: D52.2 R97.2 U2.6(OUT) U2.7(OUT) ; port H2
NetD22_2: D53.2 R111.2 U6.6(OUT) U6.7(OUT) ; port L2
NetD29_2: D54.2 R112.2 U7.6(OUT) U7.7(OUT) ; port H3
NetD36_2: D55.2 R113.2 U9.6(OUT) U9.7(OUT) ; port L3
NetJ2_01: R146.2 ; port EPWM1A
NetJ2_05: R143.2 ; port EPWM2A
NetJ2_17: R151.2 ; port EPWM3A
NetR144_2: R144.2 U1.2(IN) U3.7(HO)
NetR145_2: R145.2 U2.2(IN) U4.7(HO)
NetR149_2: R149.2 U3.5(LO) U5.2(IN)
NetR150_2: R150.2 U4.5(LO) U6.2(IN)
NetR152_2: R152.2 U7.2(IN) U8.7(HO)
NetR154_2: R154.2 U8.5(LO) U9.2(IN)

Not connected (* = marked no-connect by the designer): U1 3(EN)*; U2 3(EN)*; U5 3(EN)*; U6 3(EN)*; U7 3(EN)*; U9 3(EN)*

### Library data of the parts
C8 C9 C23 = CAP 4.7uF
C14 C15 C132-C140 C151 C152 C155-C159 C162 C164 C165 = CAP 100nF 50V SMT 0805: as C72 on sheet Mosfet; Availability: Warning; Mouser-Purchase-URL: https://snapeda.com/shop?store=Mouser&id=4217223; Price: None; DigiKey-Purchase-URL: https://snapeda.com/shop?store=DigiKey&id=4217223; Package: 0805 Wurth Electronics; Value: *; SnapEDA_Link: https://www.snapeda.com/parts/885012207098/Wurth%20Electronics%20Inc/view-part/4217223/?ref=snap; BuyPart: https://www.snapeda.com/parts/885012207098/Wurth%20Electronics%20Inc/view-part/4217223/?ref=eda
C26 C88 C153 C154 C160 C163 = CAP 10uF 0805 Ceramic: 0805 10 uF 10 V Â±10% Tolerance X7R Multilayer Ceramic Capacitor; MP: GCJ21BR71A106KE01L; MF: Murata; Package: 2012 Murata; Availability: Warning; SnapEDA_Link: https://www.snapeda.com/parts/GCJ21BR71A106KE01L/Murata%20Electronics%20North%20America/view-part/1756458/?ref=snap; Value: *; Purchase-URL: https://pricing.snapeda.com/search/part/GCJ21BR71A106KE01L/?ref=eda; Price: None; Check_prices: https://www.snapeda.com/parts/GCJ21BR71A106KE01L/Murata%20Electronics%20North%20America/view-part/1756458/?ref=eda
C89 C90 C161 = CAP 100PF 0805
D49 D51-D55 = SM15T12CAY: 21.7V Clamp 461A (8/20µs) Ipp Tvs Diode Surface Mount SMC; MP: SMBJ36CA-13-F; MF: Diodes Inc.; Package: DO-214 Diodes Inc.; Price: None; Value: *; SnapEDA_Link: https://www.snapeda.com/parts/SMBJ36CA-13-F/Diodes%20Inc./view-part/828964/?ref=snap; Availability: Unavailable
R22 R53 R84 = RES 12K 1206: Res Thick Film 1206 12K Ohm 1% 0.25W(1/4W) Â±100ppm/Â°C Pad SMD T/R; MF: TE Connectivity; MP: 1623417-1; SnapEDA_Link: https://www.snapeda.com/parts/1623417-1/TE%20Connectivity/view-part/2210700/?ref=snap; Price: None; EU_RoHS_Compliance: Compliant with Exemptions; Availability: Warning; Package: 1206; Value: *; Check_prices: https://www.snapeda.com/parts/1623417-1/TE%20Connectivity/view-part/2210700/?ref=eda
R96 R97 R110-R113 R143-R146 R149-R152 R154 = RES 47KΩ 1206: 47 kOhms ±1% 0.25W, 1/4W Chip Resistor 1206 (3216 Metric) Thick Film; MP: CRCW120647K0FKEAC; Package: None; Price: None; Value: *; Availability: Unavailable
R133-R135 = 5Ω 1206
R147 R148 R153 = RES 100KΩ 0805
U1 U2 U5-U7 U9 = IXD_614
U3 U4 U8 = 2ED21091S06F: 650 V half bridge gate driver with integrated bootstrap diode; Manufacturer: Infineon Technologies; Manufacturer Order Number: 2ED21091S06F; PackageReference: PG-DSO-8-53

## Sheet Parallel_Capacitor.SchDoc
size A4
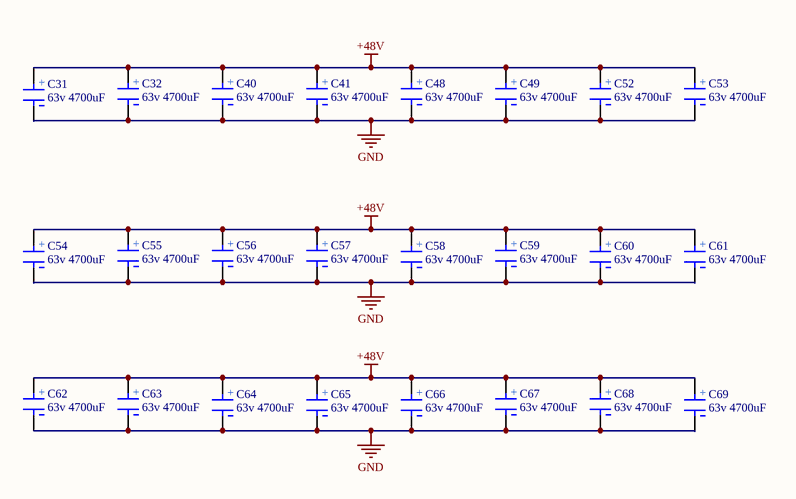
[diagram p3: Parallel_Capacitor.SchDoc]

### Parts
C31  63v 4700uF  [cap 10*20]
C32  63v 4700uF  [cap 10*20]
C40  63v 4700uF  [cap 10*20]
C41  63v 4700uF  [cap 10*20]
C48  63v 4700uF  [cap 10*20]
C49  63v 4700uF  [cap 10*20]
C52  63v 4700uF  [cap 10*20]
C53  63v 4700uF  [cap 10*20]
C54  63v 4700uF  [cap 10*20]
C55  63v 4700uF  [cap 10*20]
C56  63v 4700uF  [cap 10*20]
C57  63v 4700uF  [cap 10*20]
C58  63v 4700uF  [cap 10*20]
C59  63v 4700uF  [cap 10*20]
C60  63v 4700uF  [cap 10*20]
C61  63v 4700uF  [cap 10*20]
C62  63v 4700uF  [cap 10*20]
C63  63v 4700uF  [cap 10*20]
C64  63v 4700uF  [cap 10*20]
C65  63v 4700uF  [cap 10*20]
C66  63v 4700uF  [cap 10*20]
C67  63v 4700uF  [cap 10*20]
C68  63v 4700uF  [cap 10*20]
C69  63v 4700uF  [cap 10*20]

### Nets
+48V: C31.1 C32.1 C40.1 C41.1 C48.1 C49.1 C52.1 C53.1 C54.1 C55.1 C56.1 C57.1 C58.1 C59.1 C60.1 C61.1 C62.1 C63.1 C64.1 C65.1 C66.1 C67.1 C68.1 C69.1
GND: C31.2 C32.2 C40.2 C41.2 C48.2 C49.2 C52.2 C53.2 C54.2 C55.2 C56.2 C57.2 C58.2 C59.2 C60.2 C61.2 C62.2 C63.2 C64.2 C65.2 C66.2 C67.2 C68.2 C69.2

### Notes on the sheet
- (in symbol capacitor 10*20) +

### Library data of the parts
C31 C32 C40 C41 C48 C49 C52-C69 = capacitor 10*20: PKL5-063V472MM450 Aluminum Electrolytic Capacitors - Snap In 63volts 4700uF 20%; Manufacturer: Nichicon; Manufacturer Part Number: LKS1J472MESZ; Capacitance: 4.7mF; Ripple Current: 3A; Life (Hours): 1000Hour; Supplier 1: Mouser; RoHS: Yes; Mount: Through Hole; Case/Package: Radial; Min Operating Temperature: -40°C; Max Operating Temperature: 85°C; Package Quantity: 250; Voltage Rating: 63V; Tolerance: 20%; Packaging: Bulk; Voltage Rating (DC): 63V; Termination: Snap in; Diameter: 22mm; Length: 45mm; Lead Pitch: 0.394inch; Height - Seated (Max): 1.772inch; Supplier Part Number 1: 647-LKS1J472MESZ; ComponentLink2Description: https://www.ozdisan.com/pasif-komponentler/kondansatorler/aluminyum-kondansatorler/PKL5-063V472MM450; ComponentLink2URL: https://www.ozdisan.com/pasif-komponentler/kondansatorler/aluminyum-kondansatorler/PKL5-063V472MM450

## Sheet Current_Sensor.SchDoc
size A4
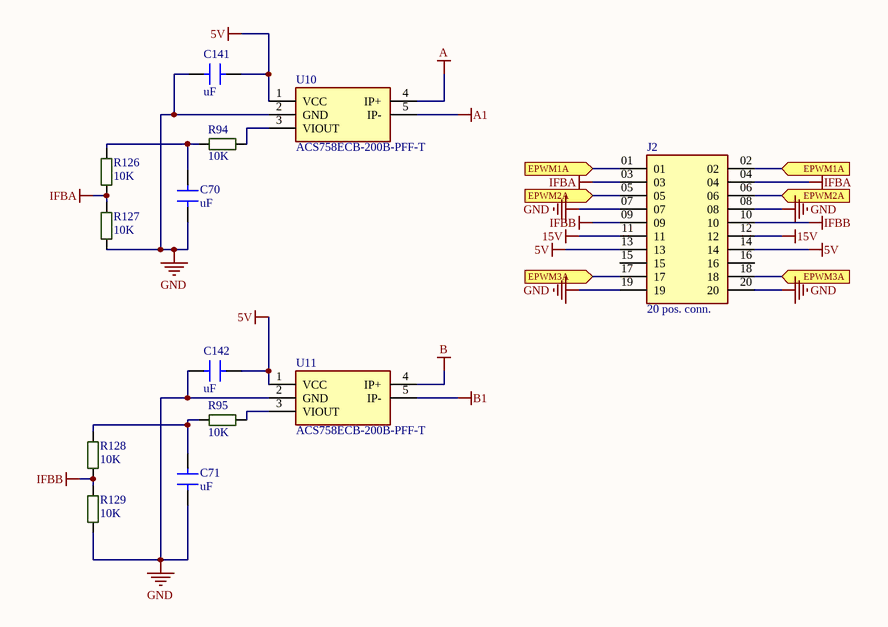
[diagram p4: Current_Sensor.SchDoc]

### Parts
C70  uF  [C-1206]
C71  uF  [C-1206]
C141  uF  [C-1206]
C142  uF  [C-1206]
J2  20 pos. conn.  [SAMTEC_SSQ-110-X-X-D]
R94  10K  [R-1206]
R95  10K  [R-1206]
R126  10K  [R-1206]
R127  10K  [R-1206]
R128  10K  [R-1206]
R129  10K  [R-1206]
U10  ACS758ECB-200B-PFF-T  [ACS756SCA-050B-PFF-T_2]
U11  ACS758ECB-200B-PFF-T  [ACS756SCA-050B-PFF-T_2]

### Ports
EPWM1A (in), EPWM2A (in), EPWM3A (in)

### Nets
5V: C141.1 C142.1 J2.13 J2.14 U10.1(VCC) U11.1(VCC)
15V: J2.11 J2.12
A: U10.4(IP+)
A1: U10.5(IP-)
B: U11.4(IP+)
B1: U11.5(IP-)
GND: C70.1 C71.1 C141.2 C142.2 J2.07 J2.08 J2.19 J2.20 R127.2 R129.2 U10.2(GND) U11.2(GND)
IFBA: J2.03 J2.04 R126.2 R127.1
IFBB: J2.09 J2.10 R128.2 R129.1
NetC70_2: C70.2 R94.2 R126.1
NetC71_2: C71.2 R95.2 R128.1
NetJ2_01: J2.01 J2.02 ; port EPWM1A
NetJ2_05: J2.05 J2.06 ; port EPWM2A
NetJ2_17: J2.17 J2.18 ; port EPWM3A
NetR94_1: R94.1 U10.3(VIOUT)
NetR95_1: R95.1 U11.3(VIOUT)

Not connected (* = marked no-connect by the designer): J2 15 16

### Library data of the parts
C70 C71 C141 C142 = C-1206
J2 = 20 pos. conn.: SSQ - Samtec 2.54mm Square Tail Dual Row Socket Strip 8.5mm Profile - Fast Stock; MP: SSQ-110-23-G-D; MF: Samtec; Purchase-URL: https://pricing.snapeda.com/search/part/SSQ-110-23-G-D/?ref=eda; Value: *; SnapEDA_Link: https://www.snapeda.com/parts/SSQ-110-23-G-D/Samtec/view-part/3247245/?ref=snap; Package: None; Check_prices: https://www.snapeda.com/parts/SSQ-110-23-G-D/Samtec/view-part/3247245/?ref=eda; Price: None; Availability: Bad
R94 R95 R126-R129 = R-1206_GS: 1206S4F1002T5E; ComponentLink1Description: link; ComponentLink1URL: https://www.ozdisan.com/pasif-komponentler/direncler/smt-smd-direncler/1206S4F1002T5E
U10 U11 = ACS758ECB-200B-PFF-T: Undefined or Miscellaneous; Manufacturer_Name: Allegro Microsystems; Datasheet Link: http://www.farnell.com/datasheets/926109.pdf; Manufacturer_Part_Number: ACS758ECB-200B-PFF-T; Arrow Part Number: ACS758ECB-200B-PFF-T; Arrow Price/Stock: https://www.arrow.com/en/products/acs758ecb-200b-pff-t/allegro-microsystems

## Nets that join several sheets
15V: Gate_Driver (24 pins), Current_Sensor (J2.11 J2.12)
+48V: Mosfet (39 pins), Parallel_Capacitor (24 pins)
A: Mosfet (14 pins), Gate_Driver (R133.2), Current_Sensor (U10.4)
A1: Mosfet (10 pins), Current_Sensor (U10.5)
B: Mosfet (14 pins), Gate_Driver (R134.2), Current_Sensor (U11.4)
B1: Mosfet (10 pins), Current_Sensor (U11.5)
GND: Mosfet (54 pins), Gate_Driver (45 pins), Parallel_Capacitor (24 pins), Current_Sensor (12 pins)
Source_3: Mosfet (24 pins), Gate_Driver (R135.2)
NetD1_2: Mosfet (14 pins), Gate_Driver (D49.2 R96.2 U1.6 U1.7)
NetD8_2: Mosfet (14 pins), Gate_Driver (D51.2 R110.2 U5.6 U5.7)
NetD15_2: Mosfet (14 pins), Gate_Driver (D52.2 R97.2 U2.6 U2.7)
NetD22_2: Mosfet (14 pins), Gate_Driver (D53.2 R111.2 U6.6 U6.7)
NetD29_2: Mosfet (14 pins), Gate_Driver (D54.2 R112.2 U7.6 U7.7)
NetD36_2: Mosfet (14 pins), Gate_Driver (D55.2 R113.2 U9.6 U9.7)
NetJ2_01: Gate_Driver (R146.2), Current_Sensor (J2.01 J2.02)
NetJ2_05: Gate_Driver (R143.2), Current_Sensor (J2.05 J2.06)
NetJ2_17: Gate_Driver (R151.2), Current_Sensor (J2.17 J2.18)